# Altium schematic sheet Debug LEDs.SchDoc
size A
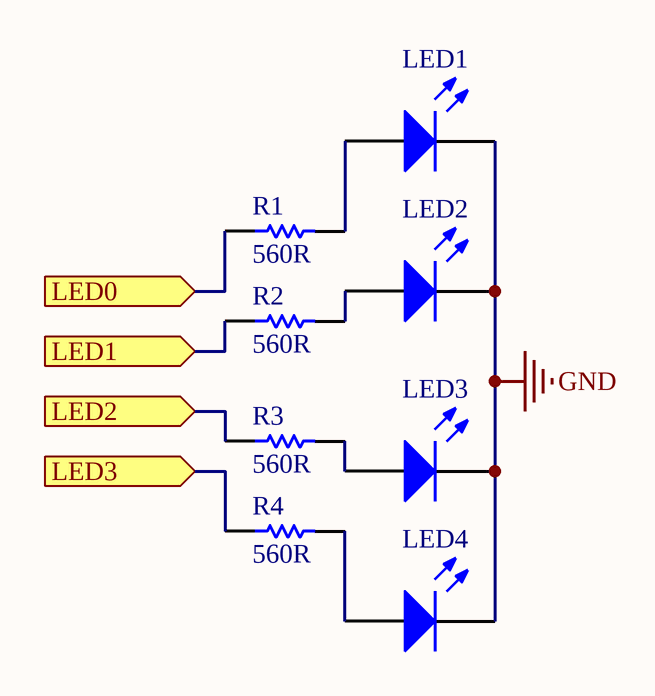
[diagram p0: Debug LEDs.SchDoc]

## Parts
LED1  150080RS75000  [0805_A]  (value not drawn)
LED2  150080GS75000  [0805_A]  (value not drawn)
LED3  150080BS75000  [0805_A]  (value not drawn)
LED4  150080YS75000  [0805_A]  (value not drawn)
R1  560R  [RESC0805(2012)_M]
R2  560R  [RESC0805(2012)_M]
R3  560R  [RESC0805(2012)_M]
R4  560R  [RESC0805(2012)_M]

## Ports
LED0 (in), LED1 (in), LED2 (in), LED3 (in)

## Nets
GND: LED1.1(K) LED2.1(K) LED3.1(K) LED4.1(K)
LED0: R1.1 ; port LED0
LED1: R2.1 ; port LED1
LED2: R3.1 ; port LED2
LED3: R4.1 ; port LED3
NetLED1_2: LED1.2(A) R1.2
NetLED2_2: LED2.2(A) R2.2
NetLED3_2: LED3.2(A) R3.2
NetLED4_2: LED4.2(A) R4.2

## Library data of the parts
LED1 = CMP-1426-00011-1: SMD mono-color Chip LED, WL-SMCW, Red; Manufacturer: Wuerth Elektronik; Color: Red; PartNumber: 150080RS75000; PackageReference: 0805_A; ComponentLink2Description: Datasheet; ComponentLink1URL: http://www.we-online.com; ComponentLink1Description: Manufacturer URL; ComponentLink2URL: http://katalog.we-online.com/led/datasheet/150080RS75000.pdf
LED2 = CMP-1426-00007-1: SMD mono-color Chip LED, WL-SMCW, Green; Manufacturer: Wuerth Elektronik; PackageReference: 0805_A; Color: Green; PartNumber: 150080GS75000; ComponentLink2URL: http://katalog.we-online.com/led/datasheet/150080GS75000.pdf; ComponentLink1URL: http://www.we-online.com; ComponentLink1Description: Manufacturer URL; ComponentLink2Description: Datasheet
LED3 = CMP-1426-00008-1: SMD mono-color Chip LED, WL-SMCW, Blue; Manufacturer: Wuerth Elektronik; Color: Blue; ComponentLink2URL: http://katalog.we-online.com/led/datasheet/150080BS75000.pdf; ComponentLink1URL: http://www.we-online.com; ComponentLink2Description: Datasheet; PackageReference: 0805_A; ComponentLink1Description: Manufacturer URL; PartNumber: 150080BS75000
LED4 = CMP-1426-00012-1: SMD mono-color Chip LED, WL-SMCW, Yellow; Manufacturer: Wuerth Elektronik; Color: Yellow; ComponentLink1URL: http://www.we-online.com; PackageReference: 0805_A; ComponentLink2URL: http://katalog.we-online.com/led/datasheet/150080YS75000.pdf; ComponentLink1Description: Manufacturer URL; ComponentLink2Description: Datasheet; PartNumber: 150080YS75000
R1-R4 = CMP-1013-00482-1: 560R 0.125W 1% 0805 (2012 Metric)  SMD; Value: 560.00 Ohm; Case-Metric: 2012; Case-EIA: 0805; Technology: SMT; Tolerance: 1 %; Power: 0.125 W